# EAGLE design main_board (EAGLE 6.4)
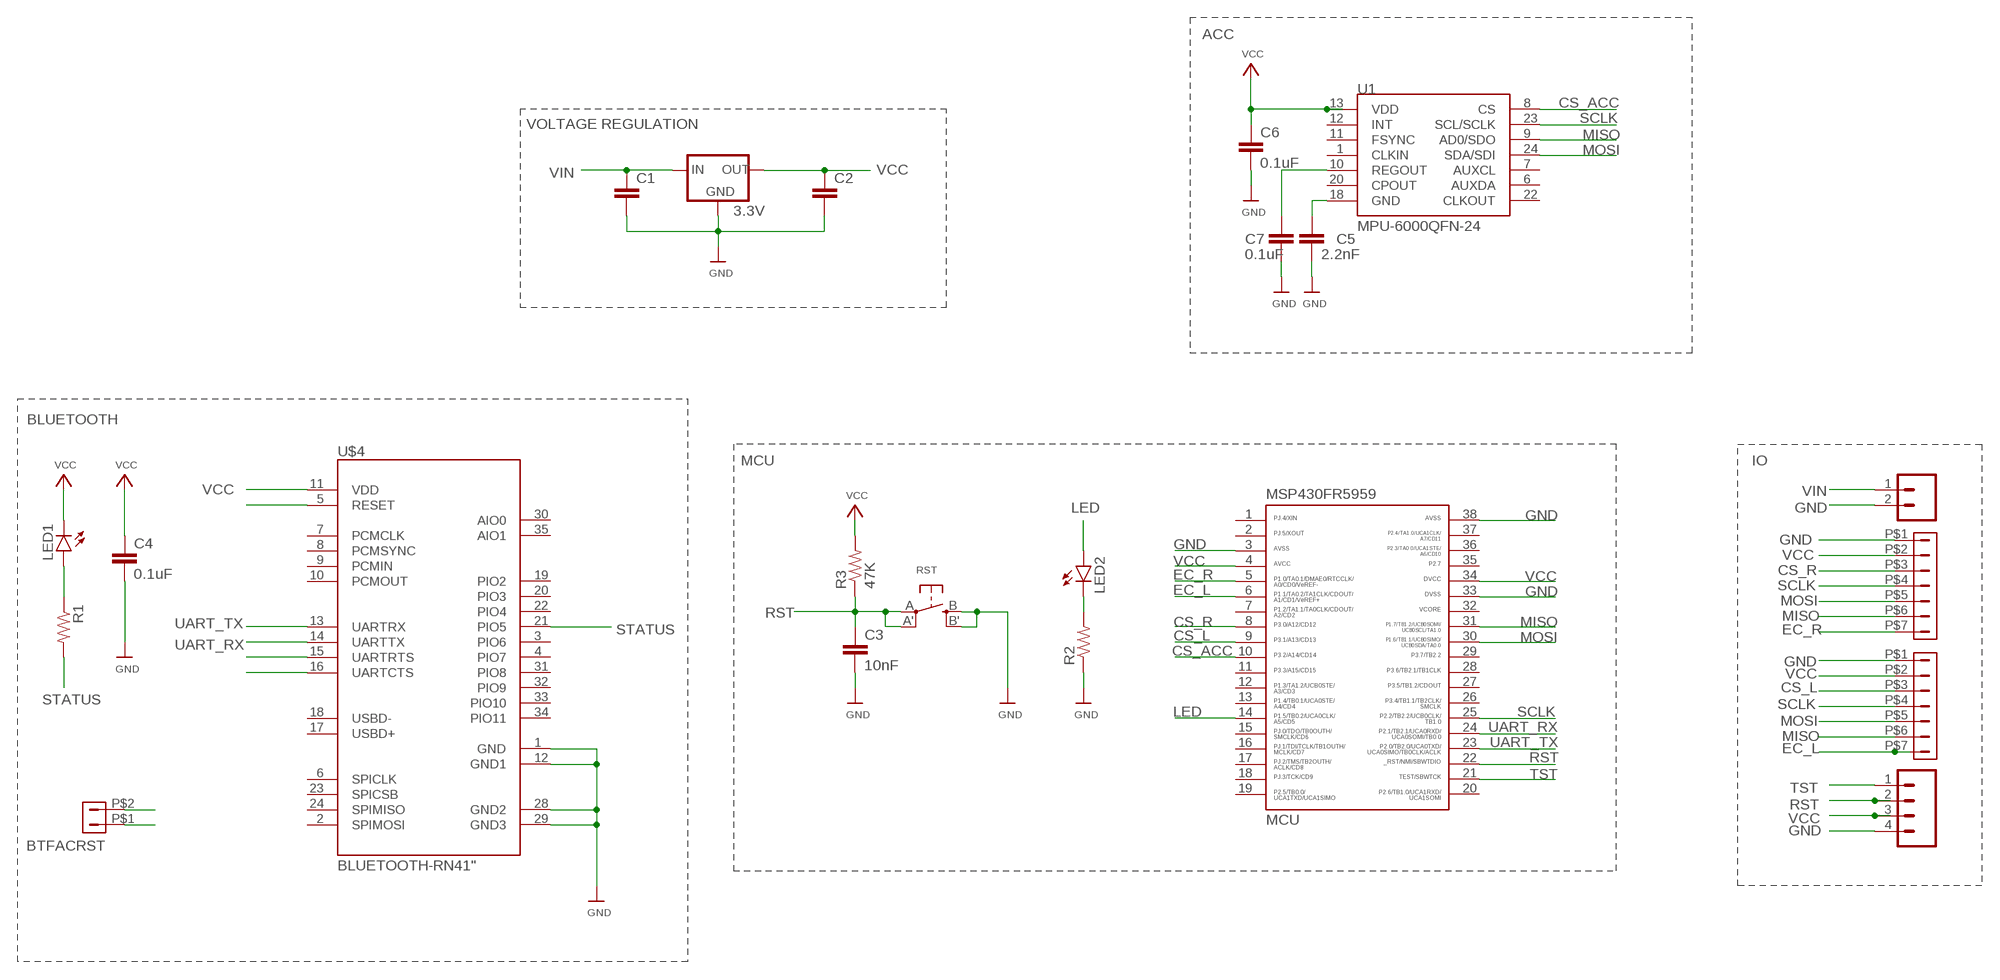
[diagram p0: schematic, sheet 1]

## Parts
3.3V  V_REG_78XX  [SOT223]
5V  M02-JST-2-PTH-NO_SILK  [JST-2-PTH-NS]
BTFACRST  DF13-2P-1.25DSA  [DF13-2P-1.25DSA]
C1  CAP0603-CAP  [0603-CAP]
C2  CAP0603-CAP  [0603-CAP]
C3  10nF  CAP0603-CAP  [0603-CAP]
C4  0.1uF  CAP0603-CAP  [0603-CAP]
C5  2.2nF  CAP0402-CAP  [0402-CAP]
C6  0.1uF  CAP0402-CAP  [0402-CAP]
C7  0.1uF  CAP0402-CAP  [0402-CAP]
LED1  LED0603  [LED-0603]
LED2  LED0603  [LED-0603]
LEFT  DF13-7P-1.25DS  [DF13-7P-1.25DS]
MCU  MSP430FR5959  MSP430FR5959-38  [TSSOP38_R-PDSO-G38-DA]
PGM  M04JST  [1X04-1.5MM_JST]
R1  RESISTOR0603-RES  [0603-RES]
R2  RESISTOR0402-RES  [0402-RES]
R3  47K  RESISTOR0402-RES  [0402-RES]
RIGHT  fname  DF13-7P-1.25DS  [DF13-7P-1.25DS]
RST  SWITCH_TACT_SMT  [EVQ-Q2]
U1  MPU-6000QFN-24  [QFN-24-TESTING]
U$4  BLUETOOTH-RN41"  [RN41]

## Nets
BTRST: BTFACRST.P$2 U$4.5(RESET)
CS_ACC: MCU.10 U1.8(CS)
CS_L: LEFT.P$3 MCU.9
CS_R: MCU.8 RIGHT.P$3
EC_L: LEFT.P$7 MCU.6
EC_R: MCU.5 RIGHT.P$7
GND: 3.3V.2(GND) 3.3V.4(GND) 5V.2 BTFACRST.P$1 C1.2 C2.2 C3.2 C4.2 C5.2 C6.2 C7.2 LEFT.P$1 MCU.3 MCU.33 MCU.38 PGM.4 R2.1 RIGHT.P$1 RST.B'(S1) RST.B(S) U$4.1(GND) U$4.12(GND1) U$4.28(GND2) U$4.29(GND3)
LED: LED2.A MCU.14
MISO: LEFT.P$6 MCU.31 RIGHT.P$6 U1.9(AD0/SDO)
MOSI: LEFT.P$5 MCU.30 RIGHT.P$5 U1.24(SDA/SDI)
N$1: LED2.C R2.2
N$3: C7.1 U1.10(REGOUT)
N$4: C5.1 U1.18(GND)
N$26: U$4.15(UARTRTS)
N$27: U$4.16(UARTCTS)
N$30: LED1.A R1.1
RST: C3.1 MCU.22 PGM.2 R3.1 RST.A'(P1) RST.A(P)
SCLK: LEFT.P$4 MCU.25 RIGHT.P$4 U1.23(SCL/SCLK)
STATUS: R1.2 U$4.21(PIO5)
TST: MCU.21 PGM.1
UART_RX: MCU.24 U$4.14(UARTTX)
UART_TX: MCU.23 U$4.13(UARTRX)
VCC: 3.3V.1(OUT) C2.1 C4.1 C6.1 LED1.C LEFT.P$2 MCU.4 MCU.34 PGM.3 R3.2 RIGHT.P$2 U1.13(VDD) U$4.11(VDD)
VIN: 3.3V.3(IN) 5V.1 C1.1
Unconnected: MCU.1 MCU.2 MCU.7 MCU.11 MCU.12 MCU.13 MCU.15 MCU.16 MCU.17 MCU.18 MCU.19 MCU.20 MCU.26 MCU.27 MCU.28 MCU.29 MCU.32 MCU.35 MCU.36 MCU.37 U1.1(CLKIN) U1.6(AUXDA) U1.7(AUXCL) U1.11(FSYNC) U1.12(INT) U1.20(CPOUT) U1.22(CLKOUT) U$4.2(SPIMOSI) U$4.3(PIO6) U$4.4(PIO7) U$4.6(SPICLK) U$4.7(PCMCLK) U$4.8(PCMSYNC) U$4.9(PCMIN) U$4.10(PCMOUT) U$4.17(USBD+) U$4.18(USBD-) U$4.19(PIO2) U$4.20(PIO3) U$4.22(PIO4) U$4.23(SPICSB) U$4.24(SPIMISO) U$4.30(AIO0) U$4.31(PIO8) U$4.32(PIO9) U$4.33(PIO10) U$4.34(PIO11) U$4.35(AIO1)

## Notes on the sheet
- ACC
- VOLTAGE REGULATION
- BLUETOOTH
- MCU | IO

## Library data of the parts
3.3V = capstone:V_REG_78XX: Voltage Regulator Standard 7805 5V regulator. IGO (Input Ground Output). Spark Fun Electronics SKU : COM-00107
5V = SparkFun-Connectors:M02: Standard 2-pin 0.1" header. Use with - straight break away headers ( PRT-00116) - right angle break away headers (PRT-00553) - swiss pins (PRT-00743) - machine pins (PRT-00117) - female headers (PRT-00115) Molex polarized connector foot print use with: PRT-08233 with associated crimp pins and housings. 2.54_SCREWTERM for use with PRT-10571. 3.5mm Screw Terminal footprints for PRT-08084 5mm Screw Terminal footprints for use with PRT-08432
BTFACRST = con-hirose-df13:DF13-2P-1.25: DF13-2P 1.25mm Pitch Miniature Crimping Connector.
C1-C7 = capstone:CAP: Capacitor Standard 0603 ceramic capacitor, and 0.1" leaded capacitor.
LED1 LED2 = capstone:LED: LEDs Standard schematic elements and footprints for 5mm, 3mm, 1206, and 0603 sized LEDs. 5mm - Spark Fun Electronics SKU : COM-00529 (and others)
LEFT RIGHT = capstone:DF13-7P-1.25: DF13-7P 1.25mm Pitch Miniature Crimping Connector.
MCU = capstone:MSP430FR5959-38
PGM = SparkFun-Connectors:M04: Header 4 Standard 4-pin 0.1" header. Use with straight break away headers (SKU : PRT-00116), right angle break away headers (PRT-00553), swiss pins (PRT-00743), machine pins (PRT-00117), and female headers (PRT-00115). Molex polarized connector foot print use with SKU : PRT-08231 with associated crimp pins and housings. 1MM SMD Version SKU: PRT-10208
R1-R3 = capstone:RESISTOR: Resistor Basic schematic elements and footprints for 0603, 1206, and PTH resistors.
RST = capstone:SWITCH_TACT_SMT: SMT Tact Switches 6x6mm - Digikey: P12940SCT-ND KMR2 (4.6x2.8mm) - Digikey: 401-1426-1-ND EVQ-PQHB55 - Light Touch, 160GF (4.5x4.5mm) - Digikey: P8090SCT-ND
U1 = SparkFun-Sensors:MPU-6000: MPU-6000 - I2C address is 0x68 with AD0 low and 0x69 with AD0 high.
U$4 = capstone:BLUETOOTH-RN41: Bluetooth SMD module

## Board
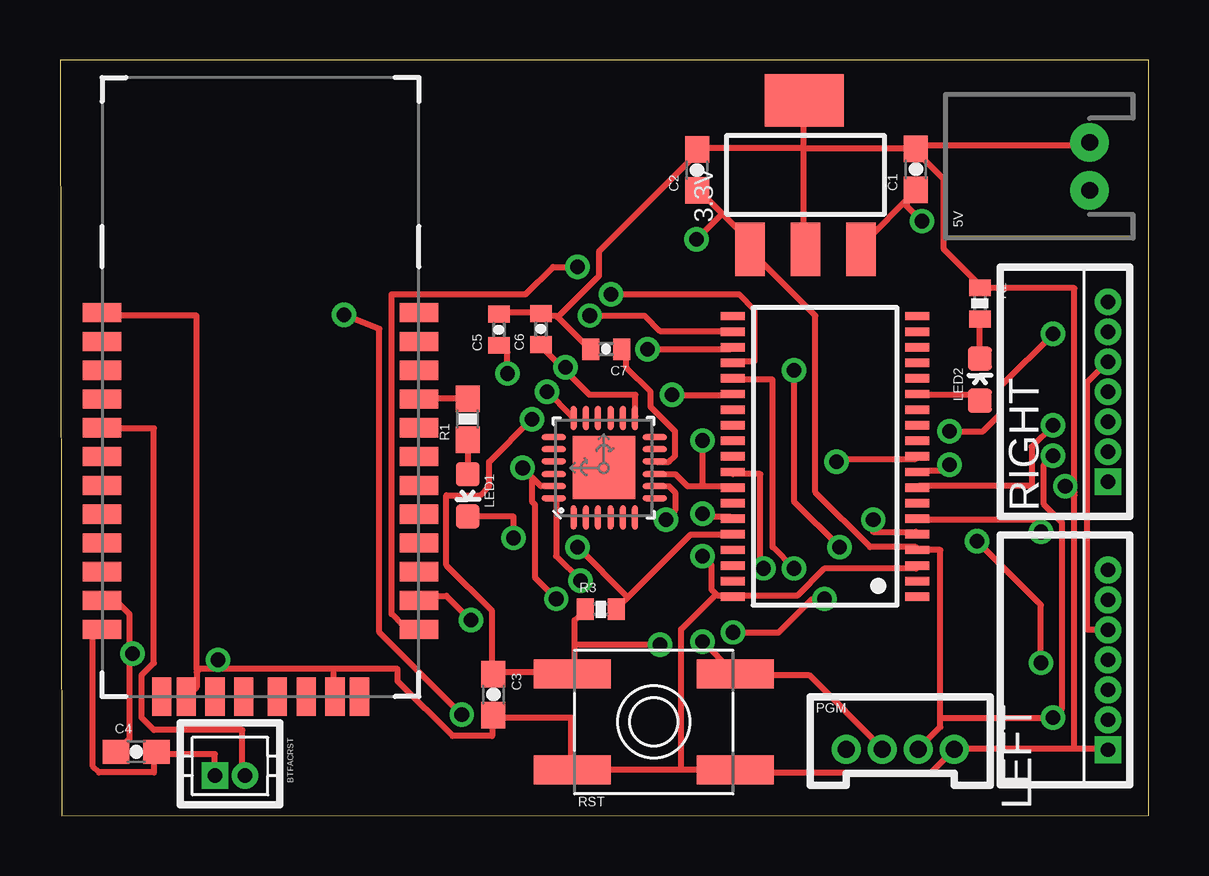
[diagram p1: board, top side]
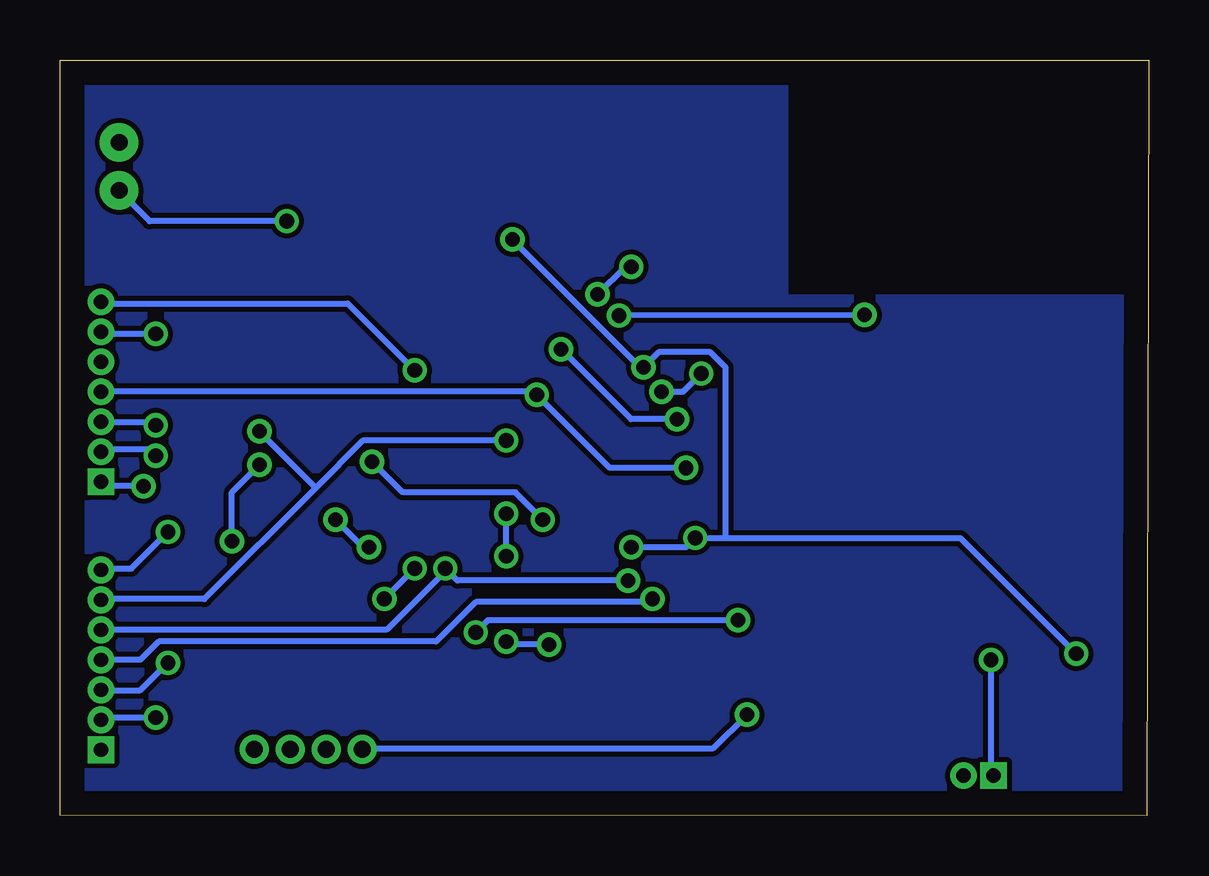
[diagram p2: board, bottom side, seen from below]

Size 45.36 x 31.51 mm. Coordinates in mm from the lower left corner, seen from the top.
Outline: 0.08,0 45.36,0.03 45.36,31.51 0,31.51 0.08,0
Copper layers (1*16): Top 0.035mm / dielectric 1.5mm / Bottom 0.035mm
Design rules "default": minimum track width 10mil, minimum drill 24mil, track to track 8mil, track to pad 8mil, pad to pad 8mil, via to via 8mil, smd to smd 8mil, copper to edge 40mil, drill to drill 8mil, minimum pad ring 10mil, minimum via ring 8mil, stop-mask expansion 4mil, vias tented up to drill 0mil, thermal gap 10mil

### Footprints (pad centres in the part's own frame; a part is rotated, then mirrored left to right if it is on the bottom)
SOT223 = smd 1.219 x 2.235: 1 -2.311,-3.099; 2 0,-3.099; 3 2.311,-3.099 | smd 3.3 x 2.2: 4 -0.05,3.1
JST-2-PTH-NS = drill 0.7 pad 1.6: 1 -1,0; 2 1,0
DF13-2P-1.25DSA = drill 0.6 pad 1.016 square: P$1 0.625,0 | drill 0.6 pad 1.016: P$2 -0.625,0
0603-CAP = smd 1.1 x 1: 1 -0.85,0; 2 0.85,0
0402-CAP = smd 0.7 x 0.9: 1 -0.65,0; 2 0.65,0
LED-0603 = smd 1 x 1: A 0,-0.877; C 0,0.877
DF13-7P-1.25DS = drill 0.6 pad 1.016 square: P$1 3.75,0 | drill 0.6 pad 1.016: P$2 2.5,0; P$3 1.25,0; P$4 0,0; P$5 -1.25,0; P$6 -2.5,0; P$7 -3.75,0
TSSOP38_R-PDSO-G38-DA = smd 0.35 x 1: 1 -5.85,-3.85; 2 -5.2,-3.85; 3 -4.55,-3.85; 4 -3.9,-3.85; 5 -3.25,-3.85; 6 -2.6,-3.85; 7 -1.95,-3.85; 8 -1.3,-3.85; 9 -0.65,-3.85; 10 0,-3.85; 11 0.65,-3.85; 12 1.3,-3.85; 13 1.95,-3.85; 14 2.6,-3.85; 15 3.25,-3.85; 16 3.9,-3.85; 17 4.55,-3.85; 18 5.2,-3.85; 19 5.85,-3.85; 20 5.85,3.85; 21 5.2,3.85; 22 4.55,3.85; 23 3.9,3.85; 24 3.25,3.85; 25 2.6,3.85; 26 1.95,3.85; 27 1.3,3.85; 28 0.65,3.85; 29 0,3.85; 30 -0.65,3.85; 31 -1.3,3.85; 32 -1.95,3.85; 33 -2.6,3.85; 34 -3.25,3.85; 35 -3.9,3.85; 36 -4.55,3.85; 37 -5.2,3.85; 38 -5.85,3.85
1X04-1.5MM_JST = drill 0.7: 1 0,0; 2 1.5,0; 3 3,0; 4 4.5,0
0603-RES = smd 1.1 x 1: 1 -0.85,0; 2 0.85,0
0402-RES = smd 0.7 x 0.9: 1 -0.65,0; 2 0.65,0
EVQ-Q2 = smd 3.2 x 1.2: A -3.4,-2; A' 3.4,-2; B -3.4,2; B' 3.4,2
QFN-24-TESTING = smd 1.016 x 0.254: 1 -2.066,1.257; 2 -2.066,0.75; 3 -2.066,0.247; 4 -2.066,-0.287; 5 -2.066,-0.792; 6 -2.066,-1.297; 13 2.086,-1.297; 14 2.086,-0.792; 15 2.086,-0.287; 16 2.086,0.247; 17 2.086,0.75; 18 2.086,1.257 | smd 0.254 x 1.016: 7 -1.267,-2.122; 8 -0.762,-2.122; 9 -0.258,-2.122; 10 0.278,-2.122; 11 0.78,-2.122; 12 1.287,-2.122; 19 1.287,2.082; 20 0.78,2.082; 21 0.278,2.082; 22 -0.258,2.082; 23 -0.762,2.082; 24 -1.267,2.082 | smd 2.616 x 2.616: P$1 0.02,-0.01
RN41 = smd 0.8 x 1.6: 1 -6.6,-6.6; 2 -5.4,-6.6; 3 -4.2,-6.6; 4 -3,-6.6; 5 -1.8,-6.6; 6 -0.6,-6.6; 7 0.6,-6.6; 8 1.8,-6.6; 9 3,-6.6; 10 4.2,-6.6; 11 5.4,-6.6; 12 6.6,-6.6; 13 6.6,6.6; 14 5.4,6.6; 15 4.2,6.6; 16 3,6.6; 17 1.8,6.6; 18 0.6,6.6; 19 -0.6,6.6; 20 -1.8,6.6; 21 -3,6.6; 22 -4.2,6.6; 23 -5.4,6.6; 24 -6.6,6.6 | smd 1.6 x 0.8: 28 9.4,3.1; 29 9.4,-3.1; 30 9.4,4.122; 31 9.4,1.9; 32 9.4,0.7; 33 9.4,-0.7; 34 9.4,-1.9; 35 9.4,-4.122

### Placement (x,y rotation side)
3.3V  31.06,26.72 0 top
5V  42.9,27.08 90 top
BTFACRST  7.09,1.68 180 top
C1  35.66,26.95 90 top
C2  26.54,26.92 90 top
C3  18.06,5.05 270 top
C4  3.18,2.67 0 top
C5  18.29,20.27 90 top
C6  20.04,20.29 90 top
C7  22.76,19.46 180 top
LED1  16.99,13.36 180 top
LED2  38.33,18.19 0 top
LEFT  43.66,6.5 270 top
MCU  31.88,14.99 90 top
PGM  32.77,2.77 0 top
R1  16.99,16.54 90 top
R2  38.33,21.36 270 top
R3  22.53,8.61 0 top
RIGHT  43.66,17.68 270 top
RST  24.74,3.91 180 top
U1  22.66,14.5 90 top
U$1  [MMLOGO]  15.37,26.92 0 top
U$4  8.36,14.38 270 top

### Tracks (layer width: path | path; a pad name or v marks a point on that pad's centre or on a via)
BTRST
  Top 0.254: U$4.5 1.88,16.15 3.91,16.15 3.91,6.38 3.4,5.87 3.4,4.09 3.91,3.58 7.59,3.58 7.59,1.68 BTFACRST.P$2
CS_ACC  (via drill 0.61)
  Top 0.254: v32.36,14.76 32.36,14.88 35.66,14.88 MCU.10 | v25.25,12.34 25.63,12.73 25.63,13.49 25.37,13.74 24.87,13.74 U1.8
  Bottom 0.254: v32.36,14.76 31.09,13.49 26.39,13.49 v25.25,12.34
CS_L  (via drill 0.61)
  Top 0.254: v37.06,14.63 37.06,14.38 35.79,14.38 MCU.9 | v38.2,11.46 40.87,8.79 v40.87,6.38
  Bottom 0.254: v37.06,14.63 38.2,13.49 v38.2,11.46 | v40.87,6.38 42.01,5.23 43.66,5.23 LEFT.P$3
CS_R  (via drill 0.61)
  Top 0.254: v41.38,16.28 40.49,15.39 40.49,13.74 35.79,13.74 MCU.8
  Bottom 0.254: v41.38,16.28 41.5,16.41 43.66,16.41 RIGHT.P$3
EC_L  (via drill 0.61)
  Top 0.254: v40.87,11.84 40.87,12.34 35.79,12.34 MCU.6
  Bottom 0.254: v40.87,11.84 42.39,10.31 43.66,10.31 LEFT.P$7
EC_R  (via drill 0.61)
  Top 0.254: v33.88,12.34 33.88,11.84 35.66,11.84 MCU.5 | v32.49,11.2 30.58,13.11 v30.58,18.57
  Bottom 0.254: v33.88,12.34 32.74,11.2 v32.49,11.2 | v30.58,18.57 33.38,21.36 43.66,21.36 RIGHT.P$7
GND  (via drill 0.61)
  Top 0.254: 35.66,27.84 35.66,27.97 42.9,27.97 5V.2 | C5.2 18.39,20.98 20.04,20.98 C6.2 20.04,20.85 20.68,20.85 20.74,20.79 | 20.74,20.79 22.07,19.46 C7.2 | 30.96,27.84 26.64,27.84 C2.2 26.52,27.71 26.52,27.58 22.45,23.52 22.45,22.5 20.74,20.79 | 30.96,27.84 30.96,29.74 3.3V.4 | 30.96,27.84 30.96,23.65 3.3V.2 | 30.96,27.84 35.66,27.84 | 35.66,27.84 C1.2 35.66,27.71 36.8,26.57 36.8,23.65 38.33,22.12 R2.1 38.33,22 42.27,22 42.27,13.49 v41.88,13.74 42.27,13.36 42.27,2.82 | BTFACRST.P$1 6.45,2.57 4.04,2.57 C4.2 3.91,2.57 3.91,1.8 1.63,1.8 1.37,2.06 1.37,7.39 U$4.12 | 5.75,6.06 5.82,6.12 6.58,6.12 | 5.75,6.06 5.69,5.99 5.69,5.36 5.31,4.98 U$4.29 | 11.4,6.12 6.58,6.12 | 11.4,6.12 11.4,4.98 U$4.28 | U$4.1 1.88,20.85 5.69,20.85 5.69,6.12 5.75,6.06 | 6.58,6.12 v6.58,6.5 | 42.27,2.82 37.31,2.82 PGM.4 37.19,2.69 36.3,1.8 28.17,1.8 RST.B 28.04,1.93 25.88,1.93 | 42.27,2.82 43.66,2.82 LEFT.P$1 | MCU.3 35.66,10.31 31.85,10.31 30.71,9.17 28.04,9.17 MCU.38 27.91,9.17 27.41,9.17 27.34,9.23 | v26.77,12.6 26.77,12.47 27.91,12.47 MCU.33 | v26.77,10.82 27.15,10.44 27.15,9.42 27.34,9.23 | 25.88,1.93 21.44,1.93 RST.B' 21.31,1.93 21.31,4.09 18.14,4.09 C3.2 18.01,4.09 18.01,3.33 16.36,3.33 14.07,5.61 14.07,6.12 11.4,6.12 | 27.34,9.23 25.88,7.77 25.88,1.93
  Bottom 0.254: v6.58,6.5 6.58,1.68 BTFACRST.P$1 | v41.88,13.74 43.54,13.74 43.66,13.87 RIGHT.P$1 | v26.77,10.82 v26.77,12.6
LED
  Top 0.254: LED2.A 38.33,17.55 35.79,17.55 MCU.14
MISO  (via drill 0.61)
  Top 0.254: 26.77,13.74 26.14,13.74 25.63,14.25 24.87,14.25 U1.9 | 26.77,13.74 27.91,13.74 MCU.31 | 26.77,13.74 v26.77,15.65 | v41.38,20.09 39.22,17.93 39.22,16.79 38.46,16.03 v37.06,16.03
  Bottom 0.254: 34.71,13.68 32.74,15.65 v26.77,15.65 | 34.71,13.68 39.34,9.04 43.66,9.04 LEFT.P$6 | v41.38,20.09 43.66,20.09 RIGHT.P$6 | 34.71,13.68 v37.06,16.03
MOSI  (via drill 0.61)
  Top 0.254: v29.31,10.31 29.18,10.44 29.18,14.25 28.04,14.25 MCU.30 | v21.69,9.8 20.68,10.82 20.68,13.23 U1.24 | LEFT.P$5 43.66,7.77 42.77,7.77 42.77,18.06 43.66,18.95 RIGHT.P$5
  Bottom 0.254: v21.69,9.8 28.8,9.8 v29.31,10.31 29.31,10.19 31.72,7.77 43.66,7.77 LEFT.P$5
N$1
  Top 0.254: LED2.C R2.2
N$2
  pour Bottom: 0.33,0.2 0.3,0.2 0.3,21.51 15.14,21.51 15.14,21.62 15.21,21.62 15.21,31.34 45.24,31.34 45.24,0.15
N$3
  Top 0.254: C7.1 23.47,19.46 23.6,19.33 23.6,18.69 24.61,17.68 24.61,17.04 25.63,16.03 25.63,15.01 25.37,14.76 24.87,14.76 U1.10
N$4  (via drill 0.61)
  Top 0.254: v18.64,18.44 18.64,19.33 18.39,19.58 C5.1 | v20.29,17.68 21.31,16.66 U1.18
  Bottom 0.254: v18.64,18.44 19.41,17.68 v20.29,17.68
N$30
  Top 0.254: R1.1 LED1.A
RST  (via drill 0.61)
  Top 0.254: PGM.2 34.26,2.82 31.22,5.87 28.17,5.87 RST.A 28.04,5.99 v26.77,7.26 | 21.44,7.14 21.44,5.99 RST.A' 21.31,5.99 18.14,5.99 C3.1 18.01,5.99 18.01,8.53 16.1,10.44 16.1,13.36 17.5,13.36 17.88,13.74 17.88,14.76 v19.66,16.54 | 21.44,7.14 21.44,8.15 21.82,8.53 R3.1 | v24.49,19.46 27.91,19.46 MCU.22 | 21.44,7.14 v24.99,7.14
  Bottom 0.254: v24.49,19.46 21.56,16.54 v19.66,16.54 | v26.77,7.26 26.64,7.14 v24.99,7.14
SCLK  (via drill 0.61)
  Top 0.254: v25.5,17.55 27.91,17.55 MCU.25 | 19.72,14.06 20.04,13.74 20.55,13.74 U1.23 | 19.72,14.06 v19.28,14.5 | v20.68,9.04 19.79,9.93 19.79,12.98 19.66,13.11 19.66,14 19.72,14.06
  Bottom 0.254: v19.28,14.5 22.45,14.5 v25.5,17.55 25.63,17.68 RIGHT.P$4 | LEFT.P$4 42.01,6.5 41.25,7.26 29.69,7.26 28.04,8.92 20.8,8.92 v20.68,9.04
STATUS
  Top 0.254: R1.2 16.99,17.42 14.96,17.42 U$4.21
TST  (via drill 0.61)
  Top 0.254: v22.07,20.85 24.36,20.85 24.99,20.22 27.91,20.22 MCU.21 | v11.84,20.88 13.31,20.29 13.31,7.65 v16.74,4.22
  Bottom 0.254: v11.84,20.88 v22.07,20.85 | v16.74,4.22 18.14,2.82 32.74,2.82 PGM.1
UART_RX  (via drill 0.61)
  Top 0.254: v30.58,10.31 29.69,11.2 29.69,18.19 28.04,18.19 MCU.24 | v31.85,9.04 31.34,9.04 29.95,7.65 v28.04,7.65 | v17.12,8.15 16.1,9.17 14.96,9.17 14.96,9.04 U$4.14
  Bottom 0.254: v31.85,9.04 v30.58,10.31 | v28.04,7.65 27.53,8.15 v17.12,8.15
UART_TX  (via drill 0.61)
  Top 0.254: v22.96,21.74 28.3,21.74 28.93,21.11 28.93,18.95 28.04,18.95 MCU.23 | v21.56,22.89 20.55,22.89 19.41,21.74 13.82,21.74 13.82,8.41 14.33,7.9 14.83,7.9 U$4.13
  Bottom 0.254: v22.96,21.74 21.82,22.89 v21.56,22.89
VCC  (via drill 0.61)
  Top 0.254: 27.6,25.11 28.68,24.03 28.68,23.65 3.3V.1 28.8,23.52 31.47,20.85 31.47,13.49 33.76,11.2 35.66,11.2 MCU.4 35.79,11.07 36.68,11.07 36.68,4.09 | 27.6,25.11 26.64,26.06 C2.1 | 36.68,4.09 36.68,3.71 35.79,2.82 PGM.3 | 36.68,4.09 v41.38,4.09 41.76,4.47 41.76,12.22 41,12.98 41,14.63 v41.38,15.01 | 2.9,6.76 2.9,8.41 2.39,8.92 1.88,8.92 U$4.11 | 2.9,6.76 2.9,3.2 2.39,2.69 C4.1 | 20.99,18.63 22.07,17.55 23.98,17.55 23.98,16.66 U1.13 | 20.99,18.63 20.04,19.58 C6.1 | 23.66,9.11 26.26,11.71 27.91,11.71 MCU.34 | 23.66,9.11 23.22,8.66 R3.2 | v18.9,11.58 18.9,12.47 16.99,12.47 LED1.C | 23.66,9.11 v21.56,11.2 | v21.06,18.69 20.99,18.63 | v3.02,6.76 2.9,6.76 | v26.52,24.03 27.6,25.11
  Bottom 0.254: v41.38,4.09 43.66,4.09 LEFT.P$2 | v41.38,15.01 41.63,15.27 43.66,15.27 RIGHT.P$2 | v21.56,11.2 19.28,11.2 v18.9,11.58 17.63,11.58 | 17.63,11.58 17.63,18.69 18.26,19.33 20.42,19.33 v21.06,18.69 21.06,18.82 21.31,18.82 v26.52,24.03 | v3.02,6.76 7.85,11.58 17.63,11.58
VIN  (via drill 0.61)
  Top 0.254: 3.3V.3 33.38,23.77 35.66,26.06 C1.1 35.28,25.55 35.28,25.43 v35.92,24.79
  Bottom 0.254: v35.92,24.79 41.63,24.79 42.9,26.06 5V.1

### Text on the board
tCream: Version 0 January 2015 | McMaster University Capstone | EC | MISO | MOSI | CLK | CS | VCC | GND | MISO | MOSI | CLK | CS | TST | RST | VCC | GND | VCC | GND